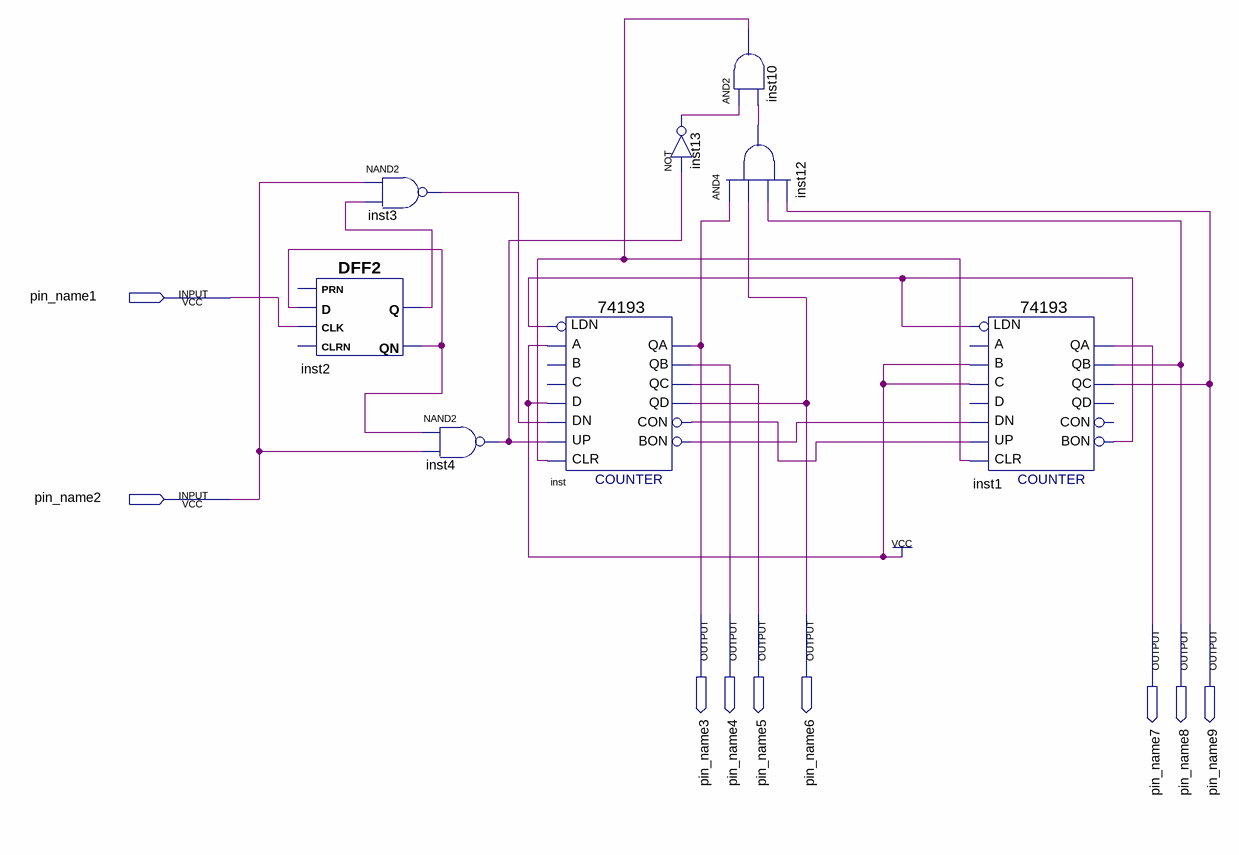
[diagram p0: schematic sheet]
// Quartus schematic licznik74193.bdf as structural Verilog: 8 symbols, 9 pins
module licznik74193 (
  input  pin_name1,
  input  pin_name2,
  output pin_name3,
  output pin_name4,
  output pin_name5,
  output pin_name6,
  output pin_name7,
  output pin_name8,
  output pin_name9
);

  wire inst1_bon, inst2_q, inst2_qn, inst3_out, inst4_out, inst10_out, inst12_out, inst13_out, inst_bon,
       inst_con;

  DFF2 inst2 (.CLK(pin_name1), .D(inst2_qn), .Q(inst2_q), .QN(inst2_qn));  // open: PRN, CLRN
  nand inst3 (inst3_out, pin_name2, inst2_q);
  nand inst4 (inst4_out, inst2_qn, pin_name2);
  \74193  inst (
    .D(1'b1), .A(1'b1), .CLR(inst10_out), .UP(inst4_out), .DN(inst3_out), .LDN(inst1_bon), .QB(pin_name4),
    .QA(pin_name3), .CON(inst_con), .QD(pin_name6), .QC(pin_name5), .BON(inst_bon));  // open: C, B
  not inst13 (inst13_out, inst4_out);
  and inst12 (inst12_out, pin_name3, pin_name6, pin_name8, pin_name9);
  and inst10 (inst10_out, inst13_out, inst12_out);
  \74193  inst1 (
    .C(1'b1), .B(1'b1), .CLR(inst10_out), .UP(inst_con), .DN(inst_bon), .LDN(inst1_bon), .QB(pin_name8),
    .QA(pin_name7), .QC(pin_name9), .BON(inst1_bon));  // open: D, A, CON, QD
endmodule
